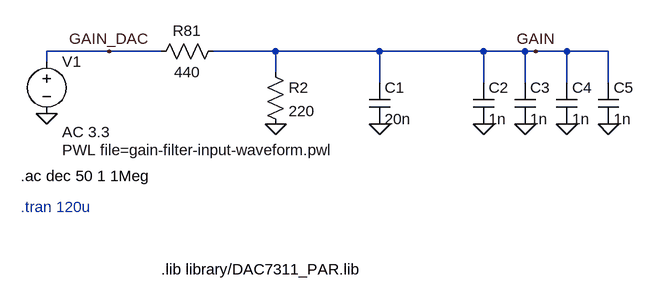
[diagram p0: schematic gain-filter.asc]
gain-filter.asc, the LTspice schematic file:
Version 4.1
SHEET 1 1140 680
WIRE 112 64 16 64
WIRE 192 64 112 64
WIRE 368 64 272 64
WIRE 528 64 368 64
WIRE 688 64 528 64
WIRE 752 64 688 64
WIRE 768 64 752 64
WIRE 816 64 768 64
WIRE 880 64 816 64
WIRE 16 80 16 64
WIRE 368 96 368 64
WIRE 528 112 528 64
WIRE 688 112 688 64
WIRE 752 112 752 64
WIRE 816 112 816 64
WIRE 880 112 880 64
FLAG 16 160 0
FLAG 368 176 0
FLAG 528 176 0
FLAG 768 64 GAIN
FLAG 112 64 GAIN_DAC
FLAG 688 176 0
FLAG 752 176 0
FLAG 816 176 0
FLAG 880 176 0
SYMBOL voltage 16 64 R0
WINDOW 3 24 152 Left 2
WINDOW 123 24 124 Left 2
WINDOW 39 0 0 Left 0
SYMATTR Value PWL file=gain-filter-input-waveform.pwl
SYMATTR Value2 AC 3.3
SYMATTR InstName V1
SYMBOL res 288 48 R90
WINDOW 0 0 56 VBottom 2
WINDOW 3 32 56 VTop 2
SYMATTR InstName R81
SYMATTR Value 440
SYMBOL res 352 80 R0
SYMATTR InstName R2
SYMATTR Value 220
SYMBOL cap 512 112 R0
SYMATTR InstName C1
SYMATTR Value 20n
SYMBOL cap 672 112 R0
SYMATTR InstName C2
SYMATTR Value 1n
SYMBOL cap 736 112 R0
SYMATTR InstName C3
SYMATTR Value 1n
SYMBOL cap 800 112 R0
SYMATTR InstName C4
SYMATTR Value 1n
SYMBOL cap 864 112 R0
SYMATTR InstName C5
SYMATTR Value 1n
TEXT -24 256 Left 2 !.ac dec 50 1 1Meg
TEXT -24 304 Left 2 ;.tran 120u
TEXT 192 400 Left 2 !.lib library/DAC7311_PAR.lib

The netlist it stands for:
* gain-filter.asc
V1 GAIN_DAC 0 PWL file=gain-filter-input-waveform.pwl AC 3.3
R81 GAIN GAIN_DAC 440
R2 GAIN 0 220
C1 GAIN 0 20n
C2 GAIN 0 1n
C3 GAIN 0 1n
C4 GAIN 0 1n
C5 GAIN 0 1n
.ac dec 50 1 1Meg
* .tran 120u
.lib library/DAC7311_PAR.lib
.backanno
.end